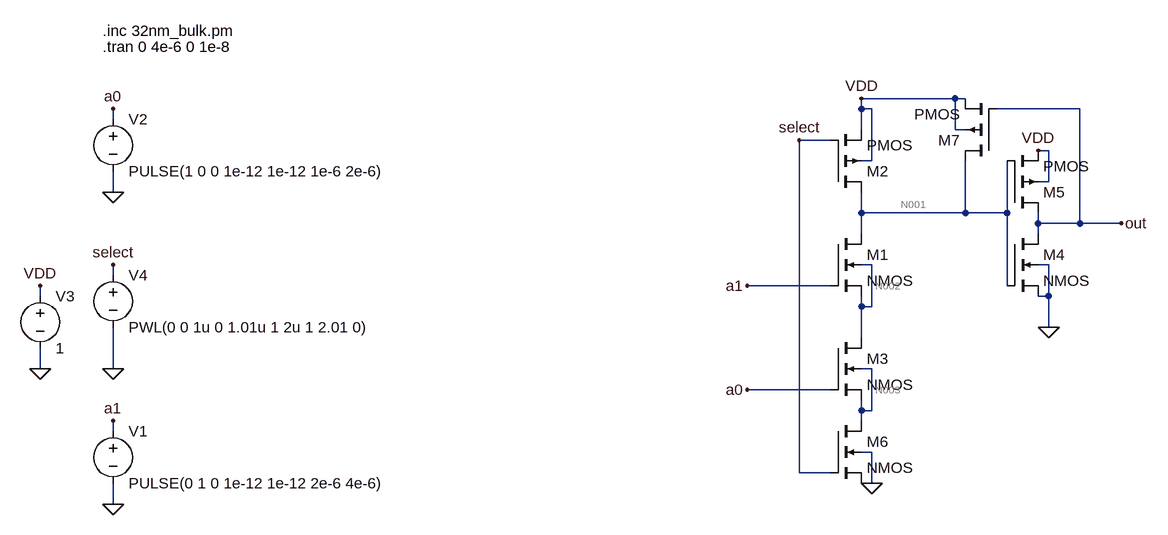
[diagram p0: schematic Charge_dec.asc]
Charge_dec.asc, the LTspice schematic file:
Version 4
SHEET 1 888 680
WIRE 576 -192 432 -192
WIRE 592 -192 576 -192
WIRE 432 -176 432 -192
WIRE 448 -176 432 -176
WIRE 768 -176 640 -176
WIRE -720 -160 -720 -176
WIRE 432 -144 432 -176
WIRE 576 -144 576 -192
WIRE 592 -144 576 -144
WIRE 384 -128 336 -128
WIRE 720 -112 704 -112
WIRE 448 -96 448 -176
WIRE 448 -96 432 -96
WIRE 720 -64 720 -112
WIRE 720 -64 704 -64
WIRE -720 -48 -720 -80
WIRE 432 -16 432 -48
WIRE 592 -16 592 -96
WIRE 592 -16 432 -16
WIRE 656 -16 656 -96
WIRE 656 -16 592 -16
WIRE 704 0 704 -16
WIRE 768 0 768 -176
WIRE 768 0 704 0
WIRE 832 0 768 0
WIRE 432 16 432 -16
WIRE 704 16 704 0
WIRE 448 64 432 64
WIRE 720 64 704 64
WIRE -720 80 -720 64
WIRE 384 96 256 96
WIRE 656 96 656 -16
WIRE -832 112 -832 96
WIRE 720 112 720 64
WIRE 720 112 704 112
WIRE 432 128 432 112
WIRE 448 128 448 64
WIRE 448 128 432 128
WIRE 720 160 720 112
WIRE 432 176 432 128
WIRE -832 224 -832 192
WIRE -720 224 -720 160
WIRE 448 224 432 224
WIRE 384 256 256 256
WIRE 432 288 432 272
WIRE 448 288 448 224
WIRE 448 288 432 288
WIRE 432 304 432 288
WIRE -720 320 -720 304
WIRE 448 352 432 352
WIRE 336 384 336 -128
WIRE 384 384 336 384
WIRE 448 400 448 352
WIRE 448 400 432 400
WIRE -720 432 -720 400
FLAG 448 400 0
FLAG 432 -192 VDD
FLAG 720 160 0
FLAG 256 96 a1
FLAG 256 256 a0
FLAG 832 0 out
FLAG -720 -48 0
FLAG -720 432 0
FLAG -720 304 a1
FLAG -720 -176 a0
FLAG -832 224 0
FLAG -832 96 VDD
FLAG -720 224 0
FLAG -720 64 select
FLAG 336 -128 select
FLAG 704 -112 VDD
SYMBOL voltage -720 304 R0
WINDOW 123 0 0 Left 0
WINDOW 39 0 0 Left 0
SYMATTR InstName V1
SYMATTR Value PULSE(0 1 0 1e-12 1e-12 2e-6 4e-6)
SYMBOL voltage -720 -176 R0
WINDOW 123 0 0 Left 0
WINDOW 39 0 0 Left 0
SYMATTR InstName V2
SYMATTR Value PULSE(1 0 0 1e-12 1e-12 1e-6 2e-6)
SYMBOL voltage -832 96 R0
WINDOW 123 0 0 Left 0
WINDOW 39 0 0 Left 0
SYMATTR InstName V3
SYMATTR Value 1
SYMBOL voltage -720 64 R0
WINDOW 123 0 0 Left 0
WINDOW 39 0 0 Left 0
SYMATTR InstName V4
SYMATTR Value PWL(0 0 1u 0 1.01u 1 2u 1 2.01 0)
SYMBOL nmos4 384 16 R0
SYMATTR InstName M1
SYMATTR Value2 l=32e-9 w=320e-9 ad=51200e-18 as=51200e-18 pd=960e-9 ps=960e-9
SYMBOL nmos4 384 176 R0
SYMATTR InstName M3
SYMATTR Value2 l=32e-9 w=320e-9 ad=51200e-18 as=51200e-18 pd=960e-9 ps=960e-9
SYMBOL nmos4 656 16 R0
SYMATTR InstName M4
SYMATTR Value2 l=32e-9 w=320e-9 ad=51200e-18 as=51200e-18 pd=960e-9 ps=960e-9
SYMBOL nmos4 384 304 R0
SYMATTR InstName M6
SYMATTR Value2 l=32e-9 w=320e-9 ad=51200e-18 as=51200e-18 pd=960e-9 ps=960e-9
SYMBOL pmos4 384 -48 M180
SYMATTR InstName M2
SYMATTR Value2 l=32e-9 w=640e-9 ad=51200e-18 as=51200e-18 pd=960e-9 ps=960e-9
SYMBOL pmos4 656 -16 M180
SYMATTR InstName M5
SYMATTR Value2 l=32e-9 w=640e-9 ad=51200e-18 as=51200e-18 pd=960e-9 ps=960e-9
SYMBOL pmos4 640 -96 R180
SYMATTR InstName M7
SYMATTR Value2 l=64e-9 w=640e-9 ad=51200e-18 as=51200e-18 pd=960e-9 ps=960e-9
TEXT -736 -296 Left 2 !.inc 32nm_bulk.pm
TEXT -736 -272 Left 2 !.tran 0 4e-6 0 1e-8

The netlist it stands for:
* Charge_dec.asc
V1 a1 0 PULSE(0 1 0 1e-12 1e-12 2e-6 4e-6)
V2 a0 0 PULSE(1 0 0 1e-12 1e-12 1e-6 2e-6)
V3 VDD 0 1
V4 select 0 PWL(0 0 1u 0 1.01u 1 2u 1 2.01 0)
M1 N001 a1 N002 N002 NMOS l=32e-9 w=320e-9 ad=51200e-18 as=51200e-18 pd=960e-9 ps=960e-9
M3 N002 a0 N003 N003 NMOS l=32e-9 w=320e-9 ad=51200e-18 as=51200e-18 pd=960e-9 ps=960e-9
M4 out N001 0 0 NMOS l=32e-9 w=320e-9 ad=51200e-18 as=51200e-18 pd=960e-9 ps=960e-9
M6 N003 select 0 0 NMOS l=32e-9 w=320e-9 ad=51200e-18 as=51200e-18 pd=960e-9 ps=960e-9
M2 N001 select VDD VDD PMOS l=32e-9 w=640e-9 ad=51200e-18 as=51200e-18 pd=960e-9 ps=960e-9
M5 out N001 VDD VDD PMOS l=32e-9 w=640e-9 ad=51200e-18 as=51200e-18 pd=960e-9 ps=960e-9
M7 N001 out VDD VDD PMOS l=64e-9 w=640e-9 ad=51200e-18 as=51200e-18 pd=960e-9 ps=960e-9
.model NMOS NMOS
.model PMOS PMOS
.lib standard.mos
.inc 32nm_bulk.pm
.tran 0 4e-6 0 1e-8
.backanno
.end

* Results of the author's LTspice run, read from the files saved beside the schematic
* Operating Point, zero values left out:
*   V(a0) = 1 V
*   V(vdd) = 1 V
*   V(n001) = 1 V
*   V(n002) = 221.3 mV
*   V(n003) = 221.3 mV
*   V(out) = 152.9 µV
*   Id(M7) = -1.908 nA
*   Ig(M7) = -84.88 pA
*   Is(M7) = 1.993 nA
*   Id(M5) = -224.5 nA
*   Ig(M5) = 42.16 pA
*   Ib(M5) = 1.023 pA
*   Is(M5) = 224.4 nA
*   Id(M2) = -6.207 nA
*   Ig(M2) = -84.61 pA
*   Is(M2) = 6.292 nA
*   Id(M6) = 1.763 nA
*   Ig(M6) = -6.184 pA
*   Is(M6) = -1.757 nA
*   Id(M4) = 224.6 nA
*   Ig(M4) = 6.033 nA
*   Is(M4) = -230.6 nA
*   Id(M3) = 220.4 pA
*   Ig(M3) = 1.543 nA
*   Is(M3) = -1.763 nA
*   Id(M1) = 2.041 nA
*   Ig(M1) = -1.82 nA
*   Is(M1) = -219.7 pA
*   I(V4) = 90.79 pA
*   I(V3) = -232.7 nA
*   I(V2) = -1.543 nA
*   I(V1) = 1.82 nA
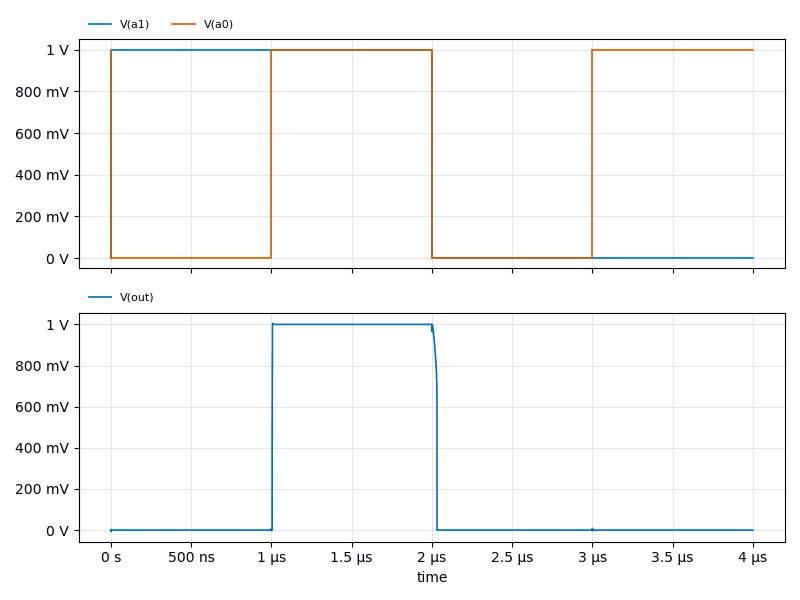
[diagram p1: Transient Analysis of Charge_dec.asc, plotted from the saved traces]
* Transient Analysis, 1 run:
*   V(a1): min 0 V, max 1 V, average 500 mV, rms 707.1 mV, last 0 V
*   V(a0): min 0 V, max 1 V, average 500 mV, rms 707.1 mV, last 1 V
*   V(out): min -5.715 mV, max 1.006 V, average 255.8 mV, rms 504.9 mV, last 154.5 µV